# EasyEDA Pro project Cool Stuff USB Hub.epro

# Schematic Schematic1
Board Name: Board1; Create Date: 2026-05-23; Page Name: P1; Project Name: DK USB HUB; Schematic Name: Schematic1; Update Date: 2026-05-23; Company: EasyEDA.com; Page Size: A4; Version: V1.0
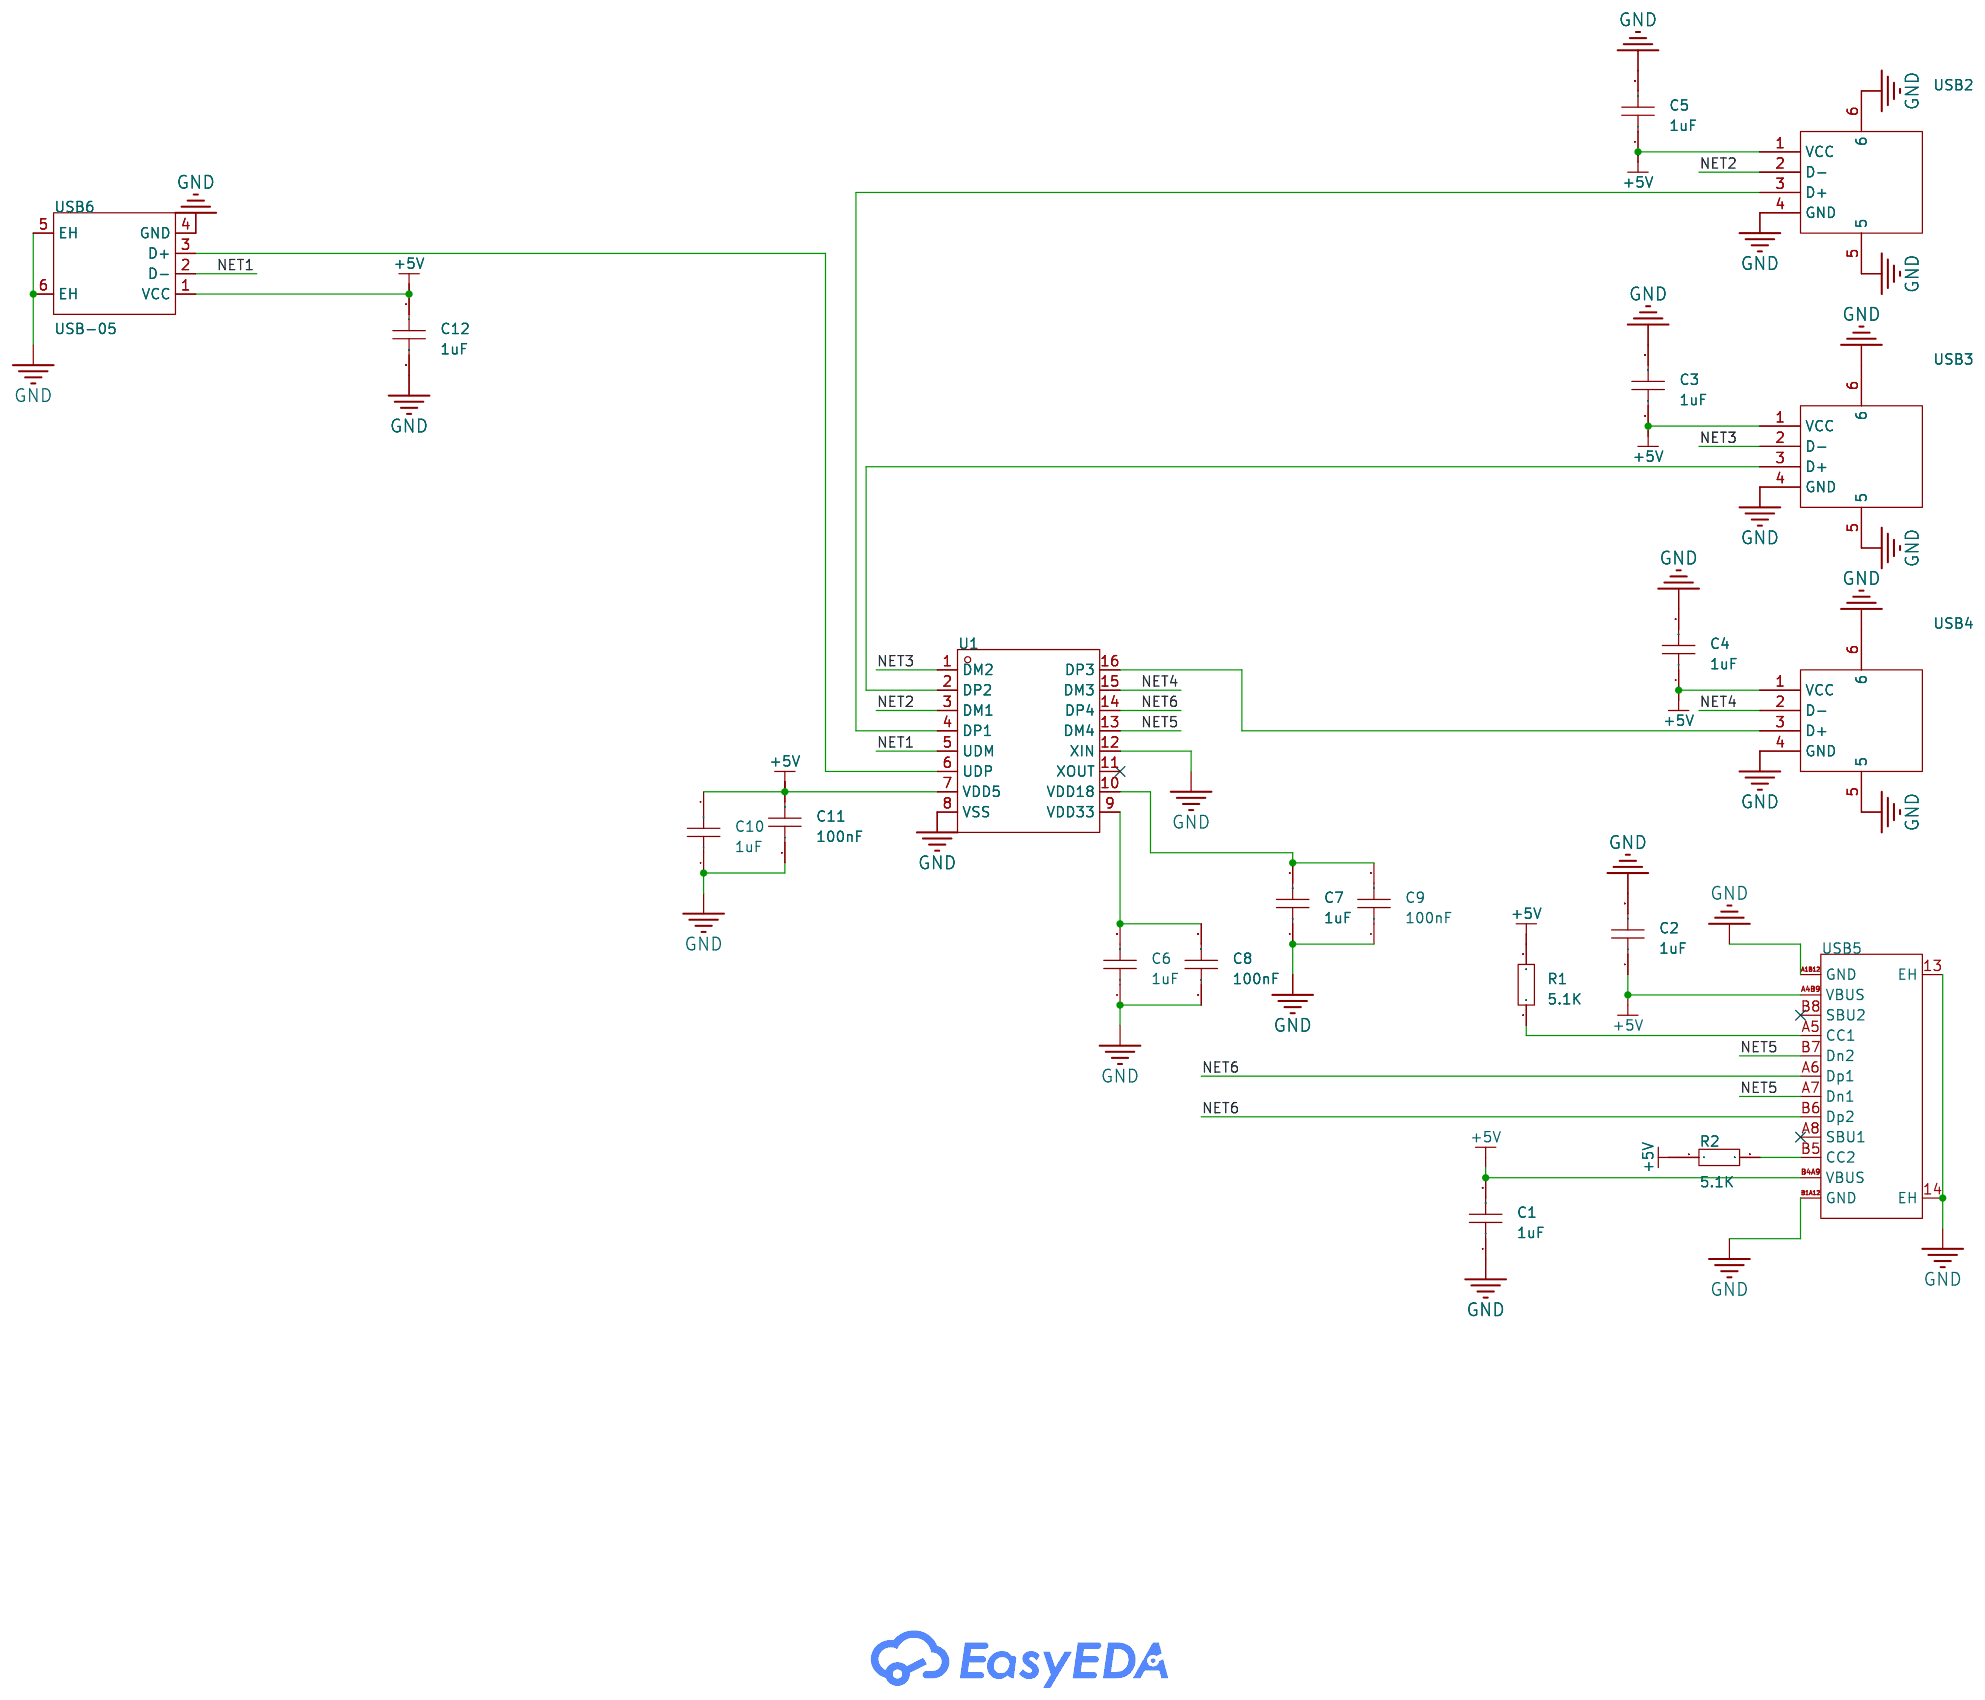
[diagram p0: schematic sheet]

## Parts
C1  1uF  [C0603]
C2  1uF  [C0603]
C3  1uF  [C0603]
C4  1uF  [C0603]
C5  1uF  [C0603]
C6  1uF  [C0603]
C7  1uF  [C0603]
C8  100nF  [C0603]
C9  100nF  [C0603]
C10  1uF  [C0603]
C11  100nF  [C0603]
C12  1uF  [C0603]
R1  5.1K  [R0603]
R2  5.1K  [R0603]
U1  SL2.1s  [SSOP-16_L4.6-W2.6-P0.53-LS4.0-BL]
USB2  10.0 QHHTZB6.3  [USB-A-TH_10.0QHHTZB6.3]
USB3  10.0 QHHTZB6.3  [USB-A-TH_10.0QHHTZB6.3]
USB4  10.0 QHHTZB6.3  [USB-A-TH_10.0QHHTZB6.3]
USB5  TYPE-C 16PIN 2MD(073)  [USB-C-SMD_TYPE-C-16PIN-2MD-073]
USB6  USB-05  [USB-A-TH_USB-05]

## Library data of the parts
C1-C12 = CAP_0603: Supplier Footprint: 0603
R1 R2 = Res_0603: Supplier Footprint: 0603
U1 = SL2.1s: type:Hub USB Protocol:USB 2.0 Data Rate:- Voltage - Supply:4V~5.25V Voltage - Supply:4V~5.25V Operating Temperature:0℃~+70℃ Operating Temperature:0℃~+70℃ Memory Interface:- Current - Supply:120mA Quiescent Supply Current:2.5mA Number of Channels:4; LCSC Part Name: USB2.0 HUB控制器集成电路; Supplier Part: C2684433; Manufacturer: CoreChips(和芯润德); Supplier Footprint: SSOP-16; JLCPCB Part Class: Extended Part; Datasheet: https://item.szlcsc.com/datasheet/SL2.1s/2782346.html; Supplier: LCSC; type: Hub; USB Protocol: USB 2.0; Voltage - Supply: 4V~5.25V; Operating Temperature: 0℃~+70℃; Current - Supply: 120mA; Quiescent Supply Current: 2.5mA; Number of Channels: 4
USB2-USB4 = 10.0 QHHTZB6.3: Connector Type:Type-A Protocol Standard:USB 2.0 Gender:Female Mounting Type:Surface Mount, Right Angle Number of Contacts:4P Number of Ports:1 Current Rating-Power:1.5A Voltage Rating:30V Connect-Disconnect Life:5,000 times Supplementary Features:- Center; LCSC Part Name: 壳长10.0mm; Supplier Part: C668591; Manufacturer: SHOU HAN(首韩); Supplier Footprint: SMD; JLCPCB Part Class: Extended Part; Datasheet: https://item.szlcsc.com/datasheet/10.0%2520QHHTZB6.3/698534.html; Supplier: LCSC; Connector Type: Type-A; Protocol Standard: USB 2.0; Gender: Female; Mounting Type: Surface Mount, Right Angle; Number of Contacts: 4P; Number of Ports: 1; Current Rating-Power: 1.5A; Voltage Rating: 30V; Connect-Disconnect Life: 5,000 times; Length: 10mm; Detection color: Black; Operating Temperature: -25℃~+85℃
USB5 = TYPE-C 16PIN 2MD(073): Connector Type:Type-C Protocol Standard:- Gender:Female Mounting Type:Surface Mount, Right Angle Number of Contacts:16P Number of Ports:1 Current Rating-Power:3A Voltage Rating:5V Connect-Disconnect Life:10,000 Cycles Supplementary Features:- Center Heigh; LCSC Part Name: Type-C 母 卧贴; Supplier Part: C2765186; Manufacturer: SHOU HAN(首韩); Supplier Footprint: SMD; JLCPCB Part Class: Extended Part; Datasheet: https://item.szlcsc.com/datasheet/TYPE-C%252016PIN%25202MD(073)/2901843.html; Supplier: LCSC; Connector Type: Type-C; Gender: Female; Mounting Type: Surface Mount, Right Angle; Number of Contacts: 16P; Number of Ports: 1; Current Rating-Power: 3A; Voltage Rating: 5V; Connect-Disconnect Life: 10,000 Cycles; Detection color: Black; Operating Temperature: -25℃~+85℃
USB6 = USB-05: Connector Type:Type-A Protocol Standard:USB 2.0 Gender:Male Mounting Type:Right Angle Number of Contacts:4P Number of Ports:1 Current Rating-Power:1A Voltage Rating:24V Length:18.75mm Operating Temperature:-35℃~+75℃ Operating Temperature:-35℃~+75℃; LCSC Part Name: Type-A 公 弯插; Supplier Part: C112454; Manufacturer: SOFNG(硕方); Supplier Footprint: 插件; JLCPCB Part Class: Extended Part; Datasheet: https://item.szlcsc.com/datasheet/USB-05/113687.html; Supplier: LCSC; Connector Type: Type-A; Protocol Standard: USB 2.0; Gender: Male; Mounting Type: Right Angle; Number of Contacts: 4P; Number of Ports: 1; Current Rating-Power: 1A; Voltage Rating: 24V; Length: 18.75mm; Operating Temperature: -35℃~+75℃

## Nets
+5V: C1.2 C2.1 C3.1 C4.1 C5.1 C10.2 C11.2 C12.1 R1.2 R2.1 U1.7(VDD5) USB2.1(VCC) USB3.1(VCC) USB4.1(VCC) USB5.A4B9(VBUS) USB5.B4A9(VBUS) USB6.1(VCC)
GND: C1.1 C2.2 C3.2 C4.2 C5.2 C6.1 C7.1 C8.1 C9.1 C10.1 C11.1 C12.2 U1.8(VSS) U1.12(XIN) USB2.4(GND) USB2.5 USB2.6 USB3.4(GND) USB3.5 USB3.6 USB4.4(GND) USB4.5 USB4.6 USB5.13(EH) USB5.14(EH) USB5.A1B12(GND) USB5.B1A12(GND) USB6.4(GND) USB6.5(EH) USB6.6(EH)
NET1: U1.5(UDM) USB6.2(D-)
NET2: U1.3(DM1) USB2.2(D-)
NET3: U1.1(DM2) USB3.2(D-)
NET4: U1.15(DM3) USB4.2(D-)
NET5: U1.13(DM4) USB5.A7(Dn1) USB5.B7(Dn2)
NET6: U1.14(DP4) USB5.A6(Dp1) USB5.B6(Dp2)
$1N1509: U1.6(UDP) USB6.3(D+)
$1N1566: U1.4(DP1) USB2.3(D+)
$1N1581: U1.2(DP2) USB3.3(D+)
$1N1599: U1.16(DP3) USB4.3(D+)
$1N1839: R2.2 USB5.B5(CC2)
$1N1844: R1.1 USB5.A5(CC1)
$1N2426: C6.2 C8.2 U1.9(VDD33)
$1N2430: C7.2 C9.2 U1.10(VDD18)

Not connected (* = marked no-connect by the designer): U1 11(XOUT)*; USB5 A8(SBU1)* B8(SBU2)*

# Board PCB1
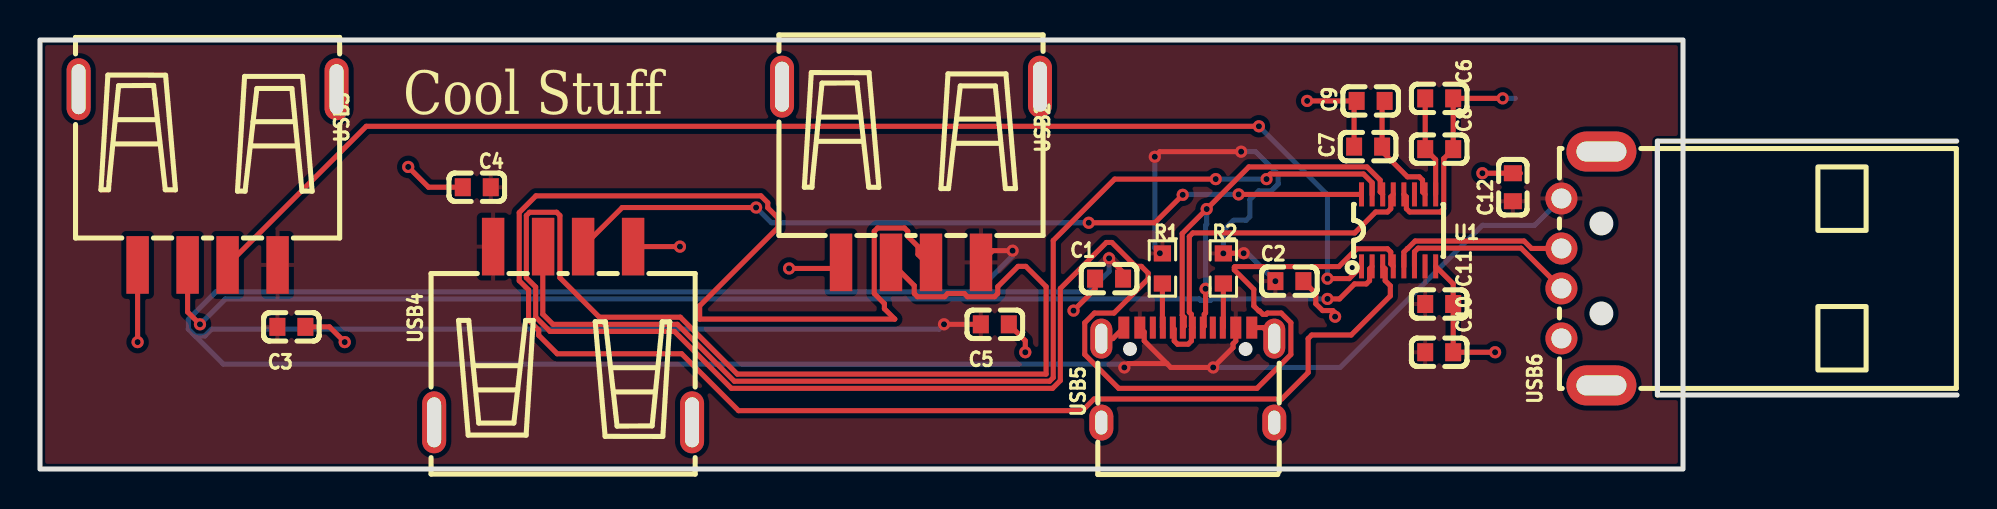
[diagram p1: board, top side]
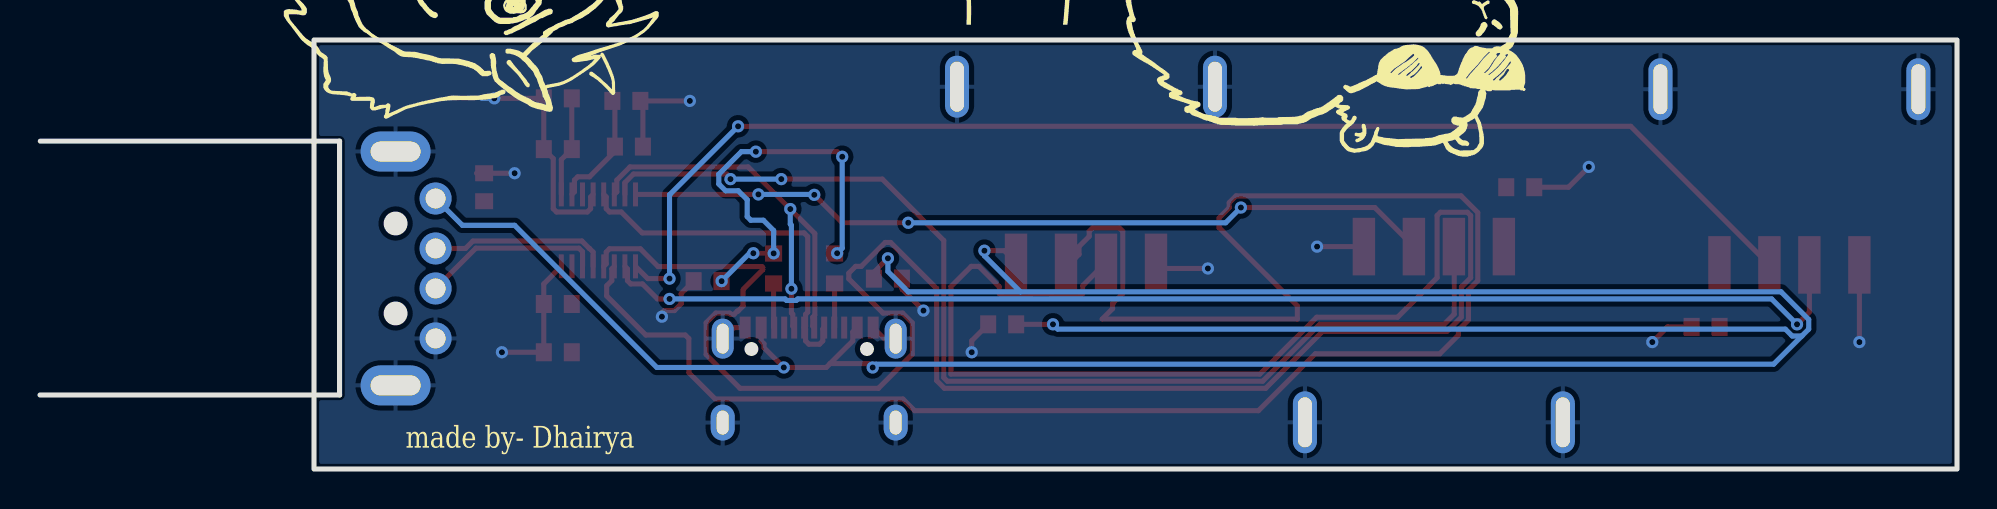
[diagram p2: board, bottom side, seen from below]

Outline 95.87 x 21.46 mm; copper layers: Top Layer, Bottom Layer. Coordinates in mm from the lower left corner of the outline.
Outline path: rectangle 0,21.46 82.17,0
Stack: Top Layer 0.035mm / Dielectric1 1.51mm FR4 er 4.5 / Bottom Layer 0.035mm

## Design rules (mm)
template: JLCPCB Capability(Two Layers Board)
spacing copperThickness1oz (default): track to track 0.102, other pairs 0.152 to 0.3
spacing copperThickness2oz: track to track 0.203, other pairs 0.152 to 0.3
track width copperThickness1oz (default): min 0.127, default 0.254, max 2.54
track width copperThickness2oz: min 0.203, default 0.254, max 2.54
differential pair differentialPair (default): width min 0.127, default 0.254, max 2.54; gap min 0.152, default 0.152
via viaSize (default): diameter min 0.5, default 0.61, max 10; hole min 0.3, default 0.305, max 6.3

## Placement (name value [footprint] x y rotation side)
C1  1uF  [C0603]  53.47 9.53 0 top
C2  1uF  [C0603]  62.48 9.4 0 top
C3  1uF  [C0603]  12.57 7.11 0 top
C4  1uF  [C0603]  21.84 14.1 180 top
C5  1uF  [C0603]  47.75 7.24 0 top
C6  1uF  [C0603]  69.98 18.54 180 top
C7  1uF  [C0603]  66.42 16.13 0 top
C8  100nF  [C0603]  69.98 16 180 top
C9  100nF  [C0603]  66.55 18.42 0 top
C10  1uF  [C0603]  69.98 5.84 180 top
C11  100nF  [C0603]  69.98 8.26 180 top
C12  1uF  [C0603]  73.66 14.1 90 top
R1  5.1K  [R0603]  56.13 10.03 90 top
R2  5.1K  [R0603]  59.18 10.03 270 top
U1  SL2.1s  [SSOP-16_L4.6-W2.6-P0.53-LS4.0-BL]  67.94 11.94 0 top
USB2  10.0 QHHTZB6.3  [USB-A-TH_10.0QHHTZB6.3]  43.56 14.73 180 top
USB3  10.0 QHHTZB6.3  [USB-A-TH_10.0QHHTZB6.3]  8.38 14.61 180 top
USB4  10.0 QHHTZB6.3  [USB-A-TH_10.0QHHTZB6.3]  26.16 6.73 0 top
USB5  TYPE-C 16PIN 2MD(073)  [USB-C-SMD_TYPE-C-16PIN-2MD-073]  57.4 4.7 0 top
USB6  USB-05  [USB-A-TH_USB-05]  77.09 10.03 90 top

## Footprints (pads in the part's own frame, mm; a bottom-side part is the same pattern mirrored in y, then rotated)
C0603
  rect 0.8x0.9 smd: 1(-0.7,0) 2(0.7,0)
R0603
  rect 0.806x0.864 smd: 1(-0.753,0) 2(0.753,0)
SSOP-16_L4.6-W2.6-P0.53-LS4.0-BL
  rect 0.25x1.2 smd: 1(-1.855,-1.8) 2(-1.325,-1.8) 3(-0.795,-1.8) 4(-0.265,-1.8) 5(0.265,-1.8) 6(0.795,-1.8) 7(1.325,-1.8) 8(1.855,-1.8) 9(1.855,1.8) 10(1.325,1.8) 11(0.795,1.8) 12(0.265,1.8) 13(-0.265,1.8) 14(-0.795,1.8) 15(-1.325,1.8) 16(-1.855,1.8)
USB-A-TH_10.0QHHTZB6.3
  rect 1.12x2.88 smd: 1(-3.5,4.395) 2(-1,4.395) 3(1,4.395) 4(3.5,4.395)
  oval 1.2x3.1 hole 0.7x2.5: 5(-6.45,-4.395) 6(6.45,-4.395)
USB-A-TH_USB-05
  round 1.6 hole 1: 1(3.5,1) 2(1,1) 3(-1,1) 4(-3.5,1)
  oval 2x3.5 hole 1x2.5: 5(-5.85,-1) 6(5.85,-1)
USB-C-SMD_TYPE-C-16PIN-2MD-073
  oval 1.1x2 hole 0.6x1.5: 13(-4.325,1.825) 14(4.325,1.825)
  oval 1.2x1.8 hole 0.6x1.2: 13(-4.325,-2.375) 14(4.325,-2.375)
  rect 0.55x1.1 smd: A1B12(-3.2,2.375) A4B9(-2.4,2.375) B1A12(3.2,2.375) B4A9(2.4,2.375)
  rect 0.3x1.1 smd: A5(-1.25,2.375) A6(-0.25,2.375) A7(0.25,2.375) A8(1.25,2.375) B5(1.75,2.375) B6(0.75,2.375) B7(-0.75,2.375) B8(-1.75,2.375)

## Nets
As in the schematic.

Pads without a net: U1 11; USB5 A8 B8

## Via types
v1: diameter 0.61, hole 0.305, Top Layer to Bottom Layer, 36 vias

## Routing (per net, layer and track width the routed paths; a pad name or vN(x,y) marks a point on that pad's centre or on a via; arc(x,y) is an arc through that point)
+5V: length 192.4
  Top Layer w0.254: v1(53.47,10.54) 54.17,9.84 C1.2 ; v1(60.2,10.8) 59.19,10.8 v1(59.18,10.79) ; R1.2 56.02,10.79 v1(56.01,10.8) ; USB2.1 47.65,10.92 v1(48.64,10.92) ; 56.36,5.27 55.22,6.41 55.22,6.85 USB5.A4B9 ; 56.36,5.27 56.55,5.08 v1(58.67,5.08) 59.66,6.07 59.66,6.26 59.8,6.4 USB5.B4A9 ; 56.36,5.27 54.42,5.27 v1(54.23,5.08) ; v1(60.07,15.88) 56.01,15.88 v1(55.75,15.62) ; C5.1 v1(45.21,7.24)
  Bottom Layer w0.254: v1(61.78,9.4) 60.39,10.8 v1(60.2,10.8) ; v1(76.09,13.53) 74.75,12.19 72.14,12.19 65.02,5.08 v1(58.67,5.08) ; 46.84,8.87 48.64,10.67 v1(48.64,10.92) ; 46.84,8.87 8.8,8.87 7.42,7.48 7.42,7 7.76,6.66 ; 46.84,8.87 52.45,8.87 53.47,9.88 v1(53.47,10.54) ; v1(54.23,5.08) 54.06,5.25 9.17,5.25 7.76,6.66 ; v1(45.21,7.24) 44.97,7 8.58,7 8.24,6.66 7.76,6.66 ; v1(60.07,15.88) 60.79,15.88 61.93,14.75 61.93,14.26 61.58,13.92 60.95,13.92 60.5,13.47 60.5,12.63 60.32,12.45 59.7,12.45 59.18,11.93 v1(59.18,10.79) ; v1(56.01,10.8) 55.75,11.05 v1(55.75,15.62)
GND: length 48.6
  Top Layer w0.254: C5.2 49.28,6.42 v1(49.28,5.84) ; USB5.A1B12 53.65,6.52 USB5.13 ; C3.2 14.48,7.11 v1(15.24,6.35) ; USB2.4 39.76,10.03 v1(37.47,10.03) ; C2.2 63.81,8.78 63.81,8.27 64.15,7.93 64.66,7.93 64.77,7.81 v1(64.77,7.62) ; v1(51.69,7.93) 52.77,9 C1.1 ; v1(18.41,15.11) 19.43,14.1 C4.2 ; U1.12 68.34,13.61 68.34,13.02 68.5,12.86 70.04,12.86 70.2,13.02 70.2,15.53 C8.1 C6.1 v1(73.15,18.54) ; 69.8,10.14 70.68,9.26 C11.1 C10.1 v1(72.77,5.84) ; 74.04,14.8 v1(72.14,14.8) ; C7.1 65.72,18.29 C9.1 v1(63.37,18.42) ; USB5.14 61.18,7.07 USB5.B1A12 ; USB3.4 v1(4.88,6.35) ; USB4.4 v1(32,11.13)
  Bottom Layer w0.254: v1(73.15,18.54) 73.79,18.54
NET1: length 9
  Top Layer w0.254: USB6.2 74.59,11.03 74.22,11.41 68.77,11.41 68.4,11.03 68.39,11.03 68.21,10.85 U1.5
NET2: length 94.9
  Top Layer w0.254: USB2.2 44.31,10.34 43.91,10.74 43.91,11.13 43.4,11.64 43.4,11.89 43.24,12.06 41.89,12.06 41.72,11.89 41.72,8.78 42.23,8.27 42.23,8.02 42.75,7.5 32.99,7.5 32.99,8.16 36.91,12.08 36.91,12.56 36.4,13.07 36.4,13.32 36.06,13.67 24.8,13.67 23.97,12.83 23.97,9.42 24.43,8.96 24.43,7.45 24.94,6.94 24.94,6.69 25.87,5.77 32.09,5.77 34.94,2.92 52.13,2.92 52.72,3.5 62.1,3.5 63.42,4.82 63.42,6.52 63.6,6.7 65.57,6.7 67.53,8.66 67.53,9.17 67.28,9.42 67.28,10.01 U1.3
NET3: length 65.4
  Top Layer w0.254: USB3.2 16.32,17.15 v1(60.96,17.15) ; U1.1 65.48,9.53 v1(64.39,9.53)
  Bottom Layer w0.254: v1(60.96,17.15) 64.39,13.72 v1(64.39,9.53)
NET4: length 55.4
  Top Layer w0.254: v1(58.8,14.5) 53.75,14.5 50.67,11.43 50.67,4.57 50.49,4.39 34.72,4.39 31.88,7.24 25.65,7.24 25.15,7.75 25.15,11.11 USB4.2 ; U1.15 66.62,14.33 66.19,14.76 61.52,14.76 61.34,14.58 v1(61.34,14.5)
  Bottom Layer w0.254: v1(61.34,14.5) v1(58.8,14.5)
NET5: length 18.4
  Top Layer w0.254: U1.13 67.55,13.61 67.55,13.02 67.39,12.86 66.8,12.86 65.75,11.81 57.66,11.81 57.48,11.63 57.48,7.84 57.58,7.74 57.58,7.15 USB5.A7 57.58,7 57.58,6.41 57.42,6.25 56.89,6.25 56.72,6.41 56.72,7 USB5.B7
NET6: length 23.1
  Top Layer w0.254: USB5.B6 58.22,7.15 58.22,7.74 58.29,7.81 v1(58.29,9.02) ; USB5.A6 57.22,7.15 57.22,7.59 57.12,7.7 57.12,11.78 v1(58.35,13.01) 60.46,15.11 66.37,15.11 67.02,14.45 67.02,13.86 U1.14
  Bottom Layer w0.254: v1(58.35,13.01) 58.35,12.25 58.29,12.19 v1(58.29,9.02)
$1N1509: length 9
  Top Layer w0.254: 68.74,10.14 68.74,10.87 68.92,11.05 74.07,11.05 USB6.3
$1N1566: length 122.3
  Top Layer w0.254: U1.4 67.55,10.26 67.55,10.85 67.39,11.02 65.85,11.02 64.96,10.13 59.76,10.13 59.73,10.09 59.73,9.96 60.71,8.99 60.71,8.16 60.96,7.9 60.99,7.9 61.16,7.74 61.32,7.74 61.39,7.8 62.07,7.8 62.56,7.32 62.56,5.73 60.86,4.04 53.94,4.04 52.25,5.73 52.25,7.32 52.74,7.8 53.71,7.8 55.42,9.51 55.42,9.8 55.08,10.14 54.8,10.14 53.6,11.33 53.33,11.33 51.03,9.03 51.03,4.42 50.64,4.04 34.58,4.04 31.73,6.88 25.51,6.88 24.79,7.6 24.79,9.1 24.32,9.57 24.32,12.68 24.49,12.84 25.84,12.84 26,12.68 26,9.57 27.98,7.59 32.02,7.59 34.87,4.75 50.32,4.75 50.32,9.12 49.3,10.14 48.92,10.14 47.9,9.12 47.9,8.78 47.74,8.62 46.39,8.62 46.22,8.78 45.4,8.78 45.24,8.62 43.89,8.62 43.72,8.78 43.72,9.18 USB2.3
$1N1581: length 63.5
  Top Layer w0.254: USB3.3 7.38,7.86 v1(8,7.24) ; v1(64.39,8.51) 64.99,8.51 65.74,9.26 66.33,9.26 66.49,9.42 66.49,10.01 U1.2
  Bottom Layer w0.254: v1(8,7.24) 9.27,8.51 57.97,8.51 58.05,8.43 58.53,8.43 58.61,8.51 v1(64.39,8.51)
$1N1599: length 40.6
  Top Layer w0.254: v1(57.15,13.72) 55.75,12.32 v1(52.45,12.32) ; USB4.3 29.12,13.08 v1(35.81,13.08) ; U1.16 v1(59.94,13.74)
  Bottom Layer w0.254: v1(35.81,13.08) 36.58,12.32 v1(52.45,12.32) ; v1(57.15,13.72) 57.17,13.74 v1(59.94,13.74)
$1N1839: length 2.2
  Top Layer w0.254: R2.2 59.18,7.1 USB5.B5
$1N1844: length 2.2
  Top Layer w0.254: R1.1 56.13,7.09 USB5.A5
$1N2426: length 5
  Top Layer w0.254: C6.2 C8.2 69.8,15.48 69.8,13.74
$1N2430: length 6
  Top Layer w0.254: U1.10 69.14,13.86 69.14,14.45 68.98,14.62 68.39,14.62 67.12,15.89 C7.2 67.12,18.29 C9.2

## Copper pours and planes (outline as drawn; the poured copper is in the pictures)
+5V on Top Layer: -4.45,29.97 106.43,29.97 106.43,-8.13 -4.45,-8.13
GND on Bottom Layer: -6.86,29.08 102.11,29.08 102.11,-11.68 -6.86,-11.68

## Text on the board
Bottom Silkscreen Layer: made by- Dhairya
Top Silkscreen Layer: Cool Stuff
